# Altium schematic sheet SensorCaida.SchDoc
size A4
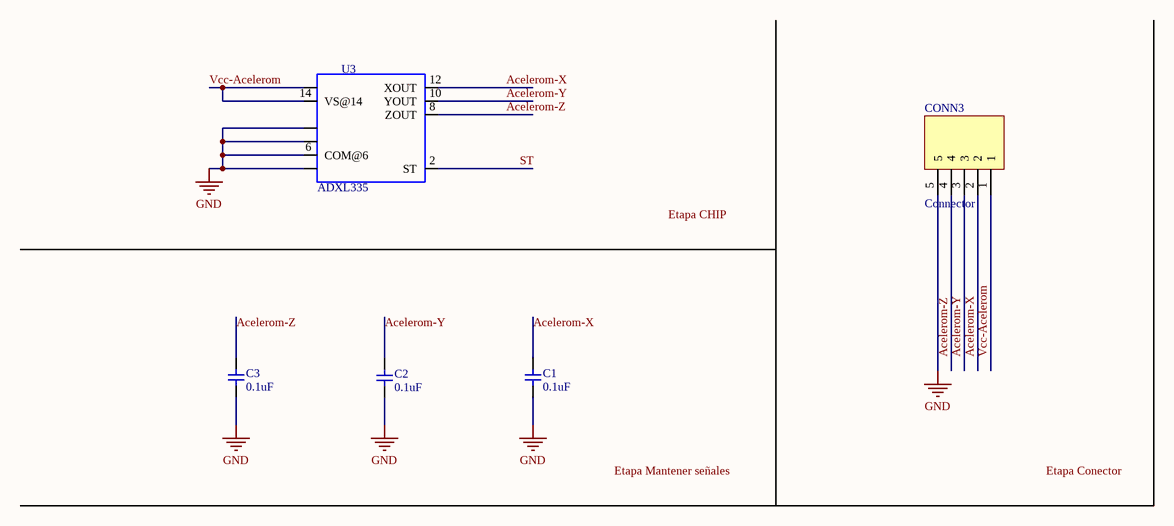
[diagram p0: SensorCaida.SchDoc]

## Parts
C1  value 0.1uF  [C1206-1.00]  (hidden comment: C)
C2  value 0.1uF  [C1206-1.00]  (hidden comment: C)
C3  value 0.1uF  [C1206-1.00]  (hidden comment: C)
CONN3  Connector  [1x5x2.54 Pin Header TH V]
U3  ADXL335  [*LFCSP-16]

## Nets
GND: C2.2 C3.2 CONN3.5 U3.3(COM@3) U3.5(COM@5) U3.6(COM@6) U3.7(COM@7)
Acelerom-X: C1.1 CONN3.2 U3.12(XOUT)
Acelerom-Y: CONN3.3 U3.10(YOUT)
Acelerom-Z: C3.1 CONN3.4 U3.8(ZOUT)
ST: U3.2(ST)
Vcc-Acelerom: CONN3.1 U3.14(VS@14) U3.15(VS@15)

Not connected (* = marked no-connect by the designer): C1 2; C2 1

## Notes on the sheet
- Labels drawn without touching a wire or pin: Etapa CHIP, Etapa Conector, Etapa Mantener señales

## Library data of the parts
C1-C3 = C: Capacitor, generic
CONN3 = Header 1x5
U3 = ADXL335: AcelerÃ³metro X, Y, Eje Z Â± 3g 1.6kHz _X, Y_, 550Hz _Z_ 16-LFCSP-LQ _4x4_; MF: Analog Devices; Price: None; SnapEDA_Link: https://www.snapeda.com/parts/ADXL335/Analog%20Devices%20Inc./view-part/3215445/?ref=snap; Availability: Unavailable; Package: LFCSP-16 Analog Devices; MP: ADXL335; Value: *; URL: https://www.snapeda.com/home/